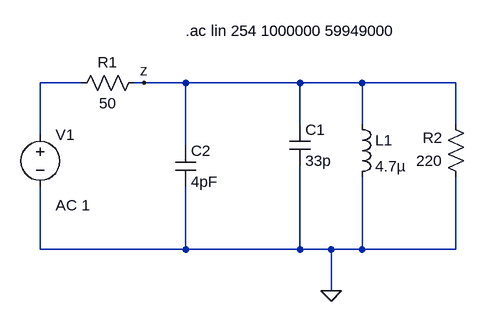
[diagram p0: schematic Test load 33p4u7R220.asc]
Test load 33p4u7R220.asc, the LTspice schematic file:
Version 4
SHEET 1 880 680
WIRE -32 64 -96 64
WIRE 64 64 48 64
WIRE 128 64 64 64
WIRE 304 64 128 64
WIRE 400 64 304 64
WIRE 544 64 400 64
WIRE 304 128 304 64
WIRE 400 128 400 64
WIRE 544 128 544 64
WIRE -96 144 -96 64
WIRE 128 160 128 64
WIRE -96 320 -96 224
WIRE 128 320 128 224
WIRE 128 320 -96 320
WIRE 304 320 304 192
WIRE 304 320 128 320
WIRE 352 320 304 320
WIRE 400 320 400 208
WIRE 400 320 352 320
WIRE 544 320 544 208
WIRE 544 320 400 320
WIRE 352 384 352 320
FLAG 352 384 0
FLAG 64 64 z
SYMBOL res 64 48 R90
WINDOW 0 0 56 VBottom 2
WINDOW 3 32 56 VTop 2
SYMATTR InstName R1
SYMATTR Value 50
SYMBOL cap 288 128 R0
SYMATTR InstName C1
SYMATTR Value 33p
SYMBOL ind 384 112 R0
SYMATTR InstName L1
SYMATTR Value 4.7µ
SYMATTR SpiceLine Rser=.5
SYMBOL voltage -96 128 R0
WINDOW 123 24 124 Left 2
WINDOW 39 0 0 Left 0
SYMATTR Value2 AC 1
SYMATTR InstName V1
SYMATTR Value ""
SYMBOL res 560 224 R180
WINDOW 0 36 76 Left 2
WINDOW 3 36 40 Left 2
SYMATTR InstName R2
SYMATTR Value 220
SYMBOL cap 112 160 R0
SYMATTR InstName C2
SYMATTR Value 4pF
TEXT 128 -16 Left 2 !.ac lin 254 1000000 59949000

The netlist it stands for:
* Test load 33p4u7R220.asc
R1 z N001 50
C1 z 0 33p
L1 z 0 4.7µ Rser=.5
V1 N001 0 AC 1
R2 0 z 220
C2 z 0 4pF
.ac lin 254 1000000 59949000
.backanno
.end